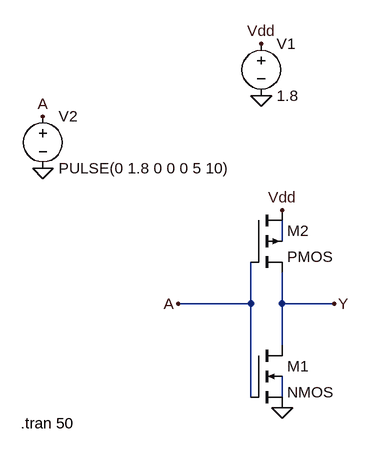
[diagram p0: schematic INV.asc]
INV.asc, the LTspice schematic file:
Version 4
SHEET 1 880 680
WIRE 128 -112 128 -144
WIRE 80 -16 80 -80
WIRE 80 -16 -32 -16
WIRE 128 -16 128 -64
WIRE 208 -16 128 -16
WIRE 128 48 128 -16
WIRE 80 128 80 -16
WIRE 128 128 128 96
FLAG -32 -16 A
FLAG 96 -416 Vdd
FLAG 128 144 0
FLAG 96 -336 0
FLAG 128 -160 Vdd
FLAG 208 -16 Y
FLAG -240 -304 A
FLAG -240 -224 0
SYMBOL voltage 96 -432 R0
WINDOW 123 0 0 Left 0
WINDOW 39 0 0 Left 0
SYMATTR InstName V1
SYMATTR Value 1.8
SYMBOL voltage -240 -320 R0
WINDOW 123 0 0 Left 0
WINDOW 39 0 0 Left 0
SYMATTR InstName V2
SYMATTR Value PULSE(0 1.8 0 0 0 5 10)
SYMBOL nmos4 80 48 R0
SYMATTR InstName M1
SYMATTR Value2 l=0.13u w=0.13u
SYMBOL pmos4 80 -160 R0
SYMATTR InstName M2
SYMATTR Value2 l=0.13u w=0.13u
TEXT -274 168 Left 2 !.tran 50

The netlist it stands for:
* INV.asc
V1 Vdd 0 1.8
V2 A 0 PULSE(0 1.8 0 0 0 5 10)
M1 Y A 0 N002 NMOS l=0.13u w=0.13u
M2 Vdd A Y N001 PMOS l=0.13u w=0.13u
.model NMOS NMOS
.model PMOS PMOS
.lib standard.mos
.tran 50
.backanno
.end